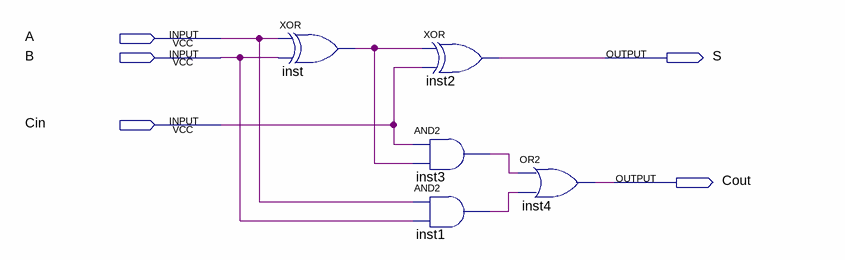
[diagram p0: schematic sheet]
// Quartus schematic FA_rca.bdf as structural Verilog: 5 symbols, 5 pins
module FA_rca (
  input  A,
  input  B,
  input  Cin,
  output S,
  output Cout
);

  wire inst1_out, inst3_out, inst_out;

  xor inst (inst_out, A, B);
  xor inst2 (S, inst_out, Cin);
  and inst3 (inst3_out, Cin, inst_out);
  and inst1 (inst1_out, A, B);
  or inst4 (Cout, inst3_out, inst1_out);
endmodule
